# Altium schematic sheet 2 - IO Socket 0.SchDoc
size A4
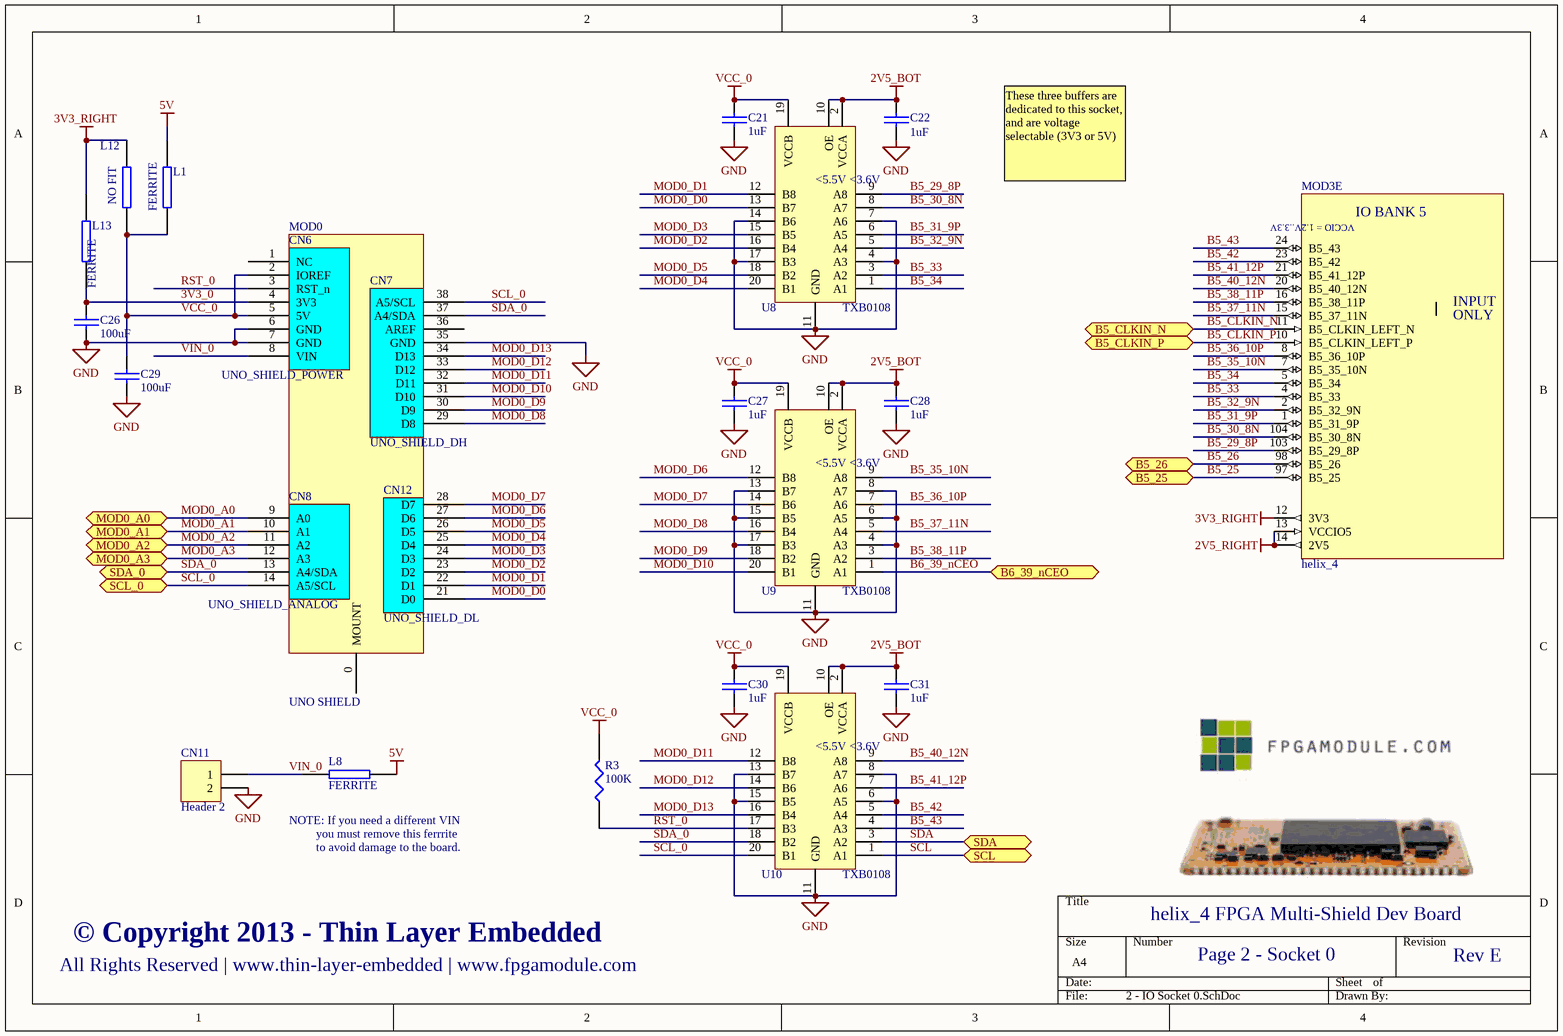
[diagram p0: 2 - IO Socket 0.SchDoc]

## Parts
C21  1uF  [0805]
C22  1uF  [0805]
C26  100uF  [1210]
C27  1uF  [0805]
C28  1uF  [0805]
C29  100uF  [1210]
C30  1uF  [0805]
C31  1uF  [0805]
CN6  UNO_SHIELD_POWER  [UNO_SHIELD_POWER]
CN7  UNO_SHIELD_DH  [UNO_SHIELD_DH]
CN8  UNO_SHIELD_ANALOG  [UNO_SHIELD_ANALOG]
CN11  Header 2  [HDR1X2]
CN12  UNO_SHIELD_DL  [UNO_SHIELD_DL]
L1  FERRITE  [0805]
L8  FERRITE  [0805]
L12  NO FIT  [0805]
L13  FERRITE  [0805]
MOD0  UNO SHIELD  [UNO_SHIELD_MECH]
MOD3  helix_4  [HELIX_4_LCC104_HOST]  (part E of 7)
R3  100K  [0805]
U8  TXB0108  [TSSOP20]
U9  TXB0108  [TSSOP20]
U10  TXB0108  [TSSOP20]

## Ports
B5_25, B5_26, B5_CLKIN_N, B5_CLKIN_P, B6_39_nCEO, MOD0_A0, MOD0_A1, MOD0_A2, MOD0_A3, SCL, SCL_0, SDA, SDA_0

## Nets
2V5_BOT: C22.2 C28.2 C31.2 U8.2(VCCA) U8.10(OE) U9.2(VCCA) U9.10(OE) U10.2(VCCA) U10.10(OE)
2V5_RIGHT: MOD3.13(VCCIO5) MOD3.14(2V5)
3V3_RIGHT: L12.1 L13.1 MOD3.12(3V3)
5V: L1.1 L8.1
GND: C21.1 C22.1 C26.2 C27.1 C28.1 C29.2 C30.1 C31.1 CN6.6(GND) CN6.7(GND) CN7.35(GND) CN11.2 U8.4(A3) U8.7(A6) U8.11(GND) U8.14(B6) U8.17(B3) U9.4(A3) U9.6(A5) U9.8(A7) U9.11(GND) U9.13(B7) U9.15(B5) U9.17(B3) U10.6(A5) U10.8(A7) U10.11(GND) U10.13(B7) U10.15(B5)
VCC_0: C21.2 C27.2 C29.1 C30.2 CN6.2(IOREF) CN6.5(5V) L1.2 L12.2 R3.2 U8.19(VCCB) U9.19(VCCB) U10.19(VCCB)
3V3_0: C26.1 CN6.4(3V3) L13.2
B5_25: MOD3.97(B5_25) ; port B5_25
B5_26: MOD3.98(B5_26) ; port B5_26
B5_29_8P: MOD3.103(B5_29_8P) U8.9(A8)
B5_30_8N: MOD3.104(B5_30_8N) U8.8(A7)
B5_31_9P: MOD3.1(B5_31_9P) U8.6(A5)
B5_32_9N: MOD3.2(B5_32_9N) U8.5(A4)
B5_33: MOD3.4(B5_33) U8.3(A2)
B5_34: MOD3.5(B5_34) U8.1(A1)
B5_35_10N: MOD3.7(B5_35_10N) U9.9(A8)
B5_36_10P: MOD3.8(B5_36_10P) U9.7(A6)
B5_37_11N: MOD3.15(B5_37_11N) U9.5(A4)
B5_38_11P: MOD3.16(B5_38_11P) U9.3(A2)
B5_40_12N: MOD3.20(B5_40_12N) U10.9(A8)
B5_41_12P: MOD3.21(B5_41_12P) U10.7(A6)
B5_42: MOD3.23(B5_42) U10.5(A4)
B5_43: MOD3.24(B5_43) U10.4(A3)
B5_CLKIN_N: MOD3.11(B5_CLKIN_LEFT_N) ; port B5_CLKIN_N
B5_CLKIN_P: MOD3.10(B5_CLKIN_LEFT_P) ; port B5_CLKIN_P
B6_39_nCEO: U9.1(A1) ; port B6_39_nCEO
MOD0_A0: CN8.9(A0) ; port MOD0_A0
MOD0_A1: CN8.10(A1) ; port MOD0_A1
MOD0_A2: CN8.11(A2) ; port MOD0_A2
MOD0_A3: CN8.12(A3) ; port MOD0_A3
MOD0_D0: CN12.21(D0) U8.13(B7)
MOD0_D1: CN12.22(D1) U8.12(B8)
MOD0_D2: CN12.23(D2) U8.16(B4)
MOD0_D3: CN12.24(D3) U8.15(B5)
MOD0_D4: CN12.25(D4) U8.20(B1)
MOD0_D5: CN12.26(D5) U8.18(B2)
MOD0_D6: CN12.27(D6) U9.12(B8)
MOD0_D7: CN12.28(D7) U9.14(B6)
MOD0_D8: CN7.29(D8) U9.16(B4)
MOD0_D9: CN7.30(D9) U9.18(B2)
MOD0_D10: CN7.31(D10) U9.20(B1)
MOD0_D11: CN7.32(D11) U10.12(B8)
MOD0_D12: CN7.33(D12) U10.14(B6)
MOD0_D13: CN7.34(D13) U10.16(B4)
RST_0: CN6.3(RST_n) R3.1 U10.17(B3)
SCL: U10.1(A1) ; port SCL
SCL_0: CN7.38(A5/SCL) CN8.14(A5/SCL) U10.20(B1) ; port SCL_0
SDA: U10.3(A2) ; port SDA
SDA_0: CN7.37(A4/SDA) CN8.13(A4/SDA) U10.18(B2) ; port SDA_0
VIN_0: CN6.8(VIN) CN11.1 L8.2

Not connected (* = marked no-connect by the designer): CN6 1(NC); CN7 36(AREF); MOD0 0(MOUNT)

## Notes on the sheet
- These three buffers are dedicated to this socket, and are voltage selectable (3V3 or 5V)
- (near L8) NOTE: If you need a different VIN
- you must remove this ferrrite
- to avoid damage to the board.
- helix_4 FPGA Multi-Shield Dev Board
- All Rights Reserved | www.thin-layer-embedded | www.fpgamodule.com
- © Copyright 2013 - Thin Layer Embedded
- Page 2 - Socket 0
- Rev E
- (in symbol helix_4 Rev C Module, part E) IO BANK 5; VCCIO = 1.2V..3.3V; INPUT; ONLY
- (in symbol TXB0108) <5.5V; <3.6V

## Library data of the parts
C21 C22 C26-C31 = CAP: Capacitor
CN11 = Header 2: Header, 2-Pin; LatestRevisionDate: 17-Jul-2002; LatestRevisionNote: Re-released for DXP Platform.; Publisher: Altium Limited
L12 = FERRITE
MOD0 = UNO_SHIELD_MECH
MOD3 = helix_4 Rev C Module
R3 = RES1
U8-U10 = TXB0108: TI Bir-dir buffer